# EAGLE design HCPL-7840 (EAGLE 6.4)
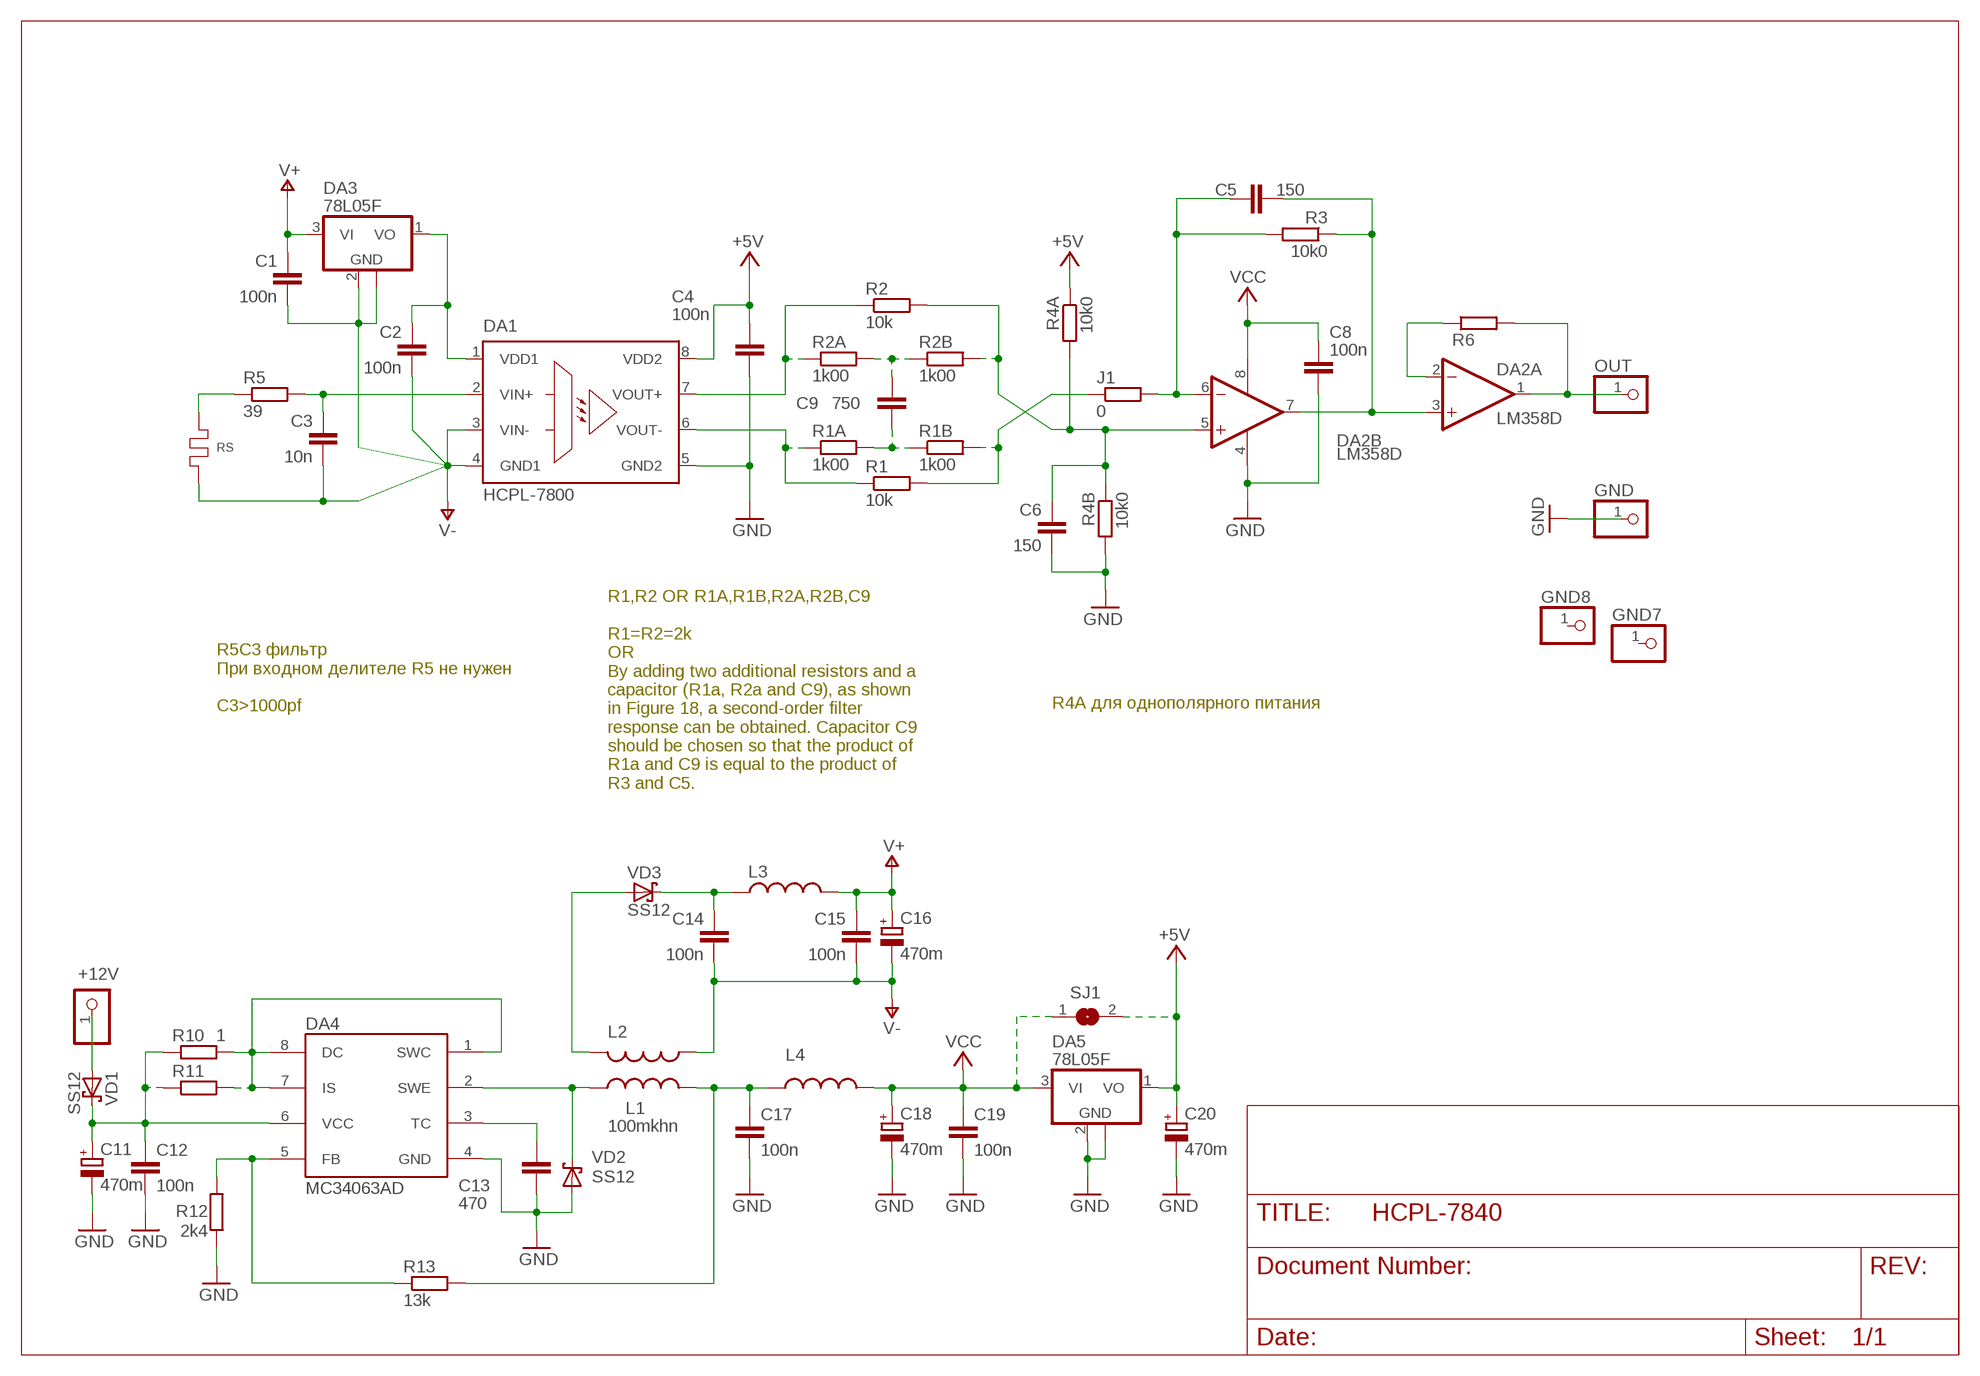
[diagram p0: schematic, sheet 1]

## Parts
+12V  PINHD-1X1  [1X01]
C1  100n  C-EUC0805  [C0805]
C2  100n  C-EU075-032X103  [C075-032X103]
C3  10n  C-EUC0805  [C0805]
C4  100n  C-EU075-032X103  [C075-032X103]
C5  150  C-EUC0805  [C0805]
C6  150  C-EUC0805  [C0805]
C8  100n  C-EU075-032X103  [C075-032X103]
C9  750  C-EUC0805  [C0805]
C11  470m  CPOL-EUE2.5-5  [E2,5-5]
C12  100n  C-EUC0805  [C0805]
C13  470  C-EUC0805  [C0805]
C14  100n  C-EUC0805  [C0805]
C15  100n  C-EUC0805  [C0805]
C16  470m  CPOL-EUE2.5-5  [E2,5-5]
C17  100n  C-EUC0805  [C0805]
C18  470m  CPOL-EUE2.5-5  [E2,5-5]
C19  100n  C-EUC0805  [C0805]
C20  470m  CPOL-EUE2.5-5  [E2,5-5]
DA1  HCPL-7800  [DIL08]
DA2  LM358D  [SO08]
DA3  78L05F  [SOT89]
DA4  MC34063AD  [SOIC8]
DA5  78L05F  [SOT89]
GND  PINHD-1X1  [1X01]
GND7  PINHD-1X1  [1X01]
GND8  PINHD-1X1  [1X01]
J1  0  R-EU_R1206W  [R1206W]
L1  100mkhn  L-USLAN02KR  [LAN02KR]
L2  L-USLAN02KR  [LAN02KR]
L3  L0204/7  [0204/7]
L4  L-US0204/7  [0204/7]
OUT  PINHD-1X1  [1X01]
R1  10k  R-EU_M0805  [M0805]
R1A  1k00  R-EU_M0805  [M0805]
R1B  1k00  R-EU_M0805  [M0805]
R2  10k  R-EU_M0805  [M0805]
R2A  1k00  R-EU_M0805  [M0805]
R2B  1k00  R-EU_M0805  [M0805]
R3  10k0  R-EU_M0805  [M0805]
R4A  10k0  R-EU_M0805  [M0805]
R4B  10k0  R-EU_M0805  [M0805]
R5  39  R-EU_M0805  [M0805]
R6  R-EU_M0805  [M0805]
R10  1  R-EU_M1206  [M1206]
R11  R-EU_M1206  [M1206]
R12  2k4  R-EU_M0805  [M0805]
R13  13k  R-EU_0207/10  [0207/10]
RS  R  [75ШС]
SJ1  SJ  [SJ]
VD1  SS12  SCHOTTKY-DIODESMD  [SMB]
VD2  SS12  SCHOTTKY-DIODESMD  [SMB]
VD3  SS12  SCHOTTKY-DIODESMD  [SMB]

## Nets
+5V: C4.1 C20.+ DA1.8(VDD2) DA5.1(VO) R4A.1 SJ1.2
GND: C4.2 C6.2 C8.2 C11.- C12.2 C13.2 C17.2 C18.- C19.2 C20.- DA1.5(GND2) DA2.4(P:V-) DA4.4(GND) DA5.2(GND) DA5.2@1(GND) GND.1 R4B.2 R12.1 VD2.A
N$1: C3.1 DA1.2(VIN+) R5.2
N$2: C2.1 DA1.1(VDD1) DA3.1(VO)
N$3: C9.2 R1A.2 R1B.1
N$4: C9.1 R2A.2 R2B.1
N$5: C5.2 DA2.3(A:+IN) DA2.7(B:OUT) R3.1
N$6: DA1.7(VOUT+) R2.1 R2A.1
N$7: DA1.6(VOUT-) R1.1 R1A.1
N$8: C6.1 DA2.5(B:+IN) R2.2 R2B.2 R4A.2 R4B.1
N$9: C5.1 DA2.6(B:-IN) J1.2 R3.2
N$10: C11.+ C12.1 DA4.6(VCC) R10.1 R11.1 VD1.C
N$11: +12V.1 VD1.A
N$12: C17.1 L1.2 L4.1 R13.2
N$13: DA2.1(A:OUT) OUT.1 R6.2
N$14: DA2.2(A:-IN) R6.1
N$16: L2.1 VD3.A
N$17: C14.1 L3.1 VD3.C
N$18: DA4.5(FB) R12.2 R13.1
N$19: J1.1 R1.2 R1B.2
N$20: DA4.1(SWC) DA4.7(IS) DA4.8(DC) R10.2 R11.2
N$21: DA4.2(SWE) L1.1 VD2.C
N$22: C13.1 DA4.3(TC)
R_SENSE: R5.1 RS.P$2
V+: C1.1 C15.1 C16.+ DA3.3(VI) L3.2
V-: C1.2 C2.2 C3.2 C14.2 C15.2 C16.- DA1.3(VIN-) DA1.4(GND1) DA3.2(GND) DA3.2@1(GND) L2.2 RS.P$1
VCC: C8.1 C18.+ C19.1 DA2.8(P:V+) DA5.3(VI) L4.2 SJ1.1
Unconnected: GND7.1 GND8.1

## Notes on the sheet
- R1,R2 OR R1A,R1B,R2A,R2B,C9
  
  R1=R2=2k
  OR
  By adding two additional resistors and a
  capacitor (R1a, R2a and C9), as shown 
  in Figure 18, a second-order filter 
  response can be obtained. Capacitor C9 
  should be chosen so that the product of 
  R1a and C9 is equal to the product of 
  R3 and C5.
- R5C3 фильтр
  При входном делителе R5 не нужен
  
  C3>1000pf
- R4A для однополярного питания

## Library data of the parts
+12V GND GND7 GND8 OUT = Разъёмы штырьковые 2.54мм:PINHD-1X1: PIN HEADER
C1-C6 C8 C9 C12-C15 C17 C19 = rcl:C-EU: CAPACITOR, European symbol
C11 C16 C18 C20 = rcl:CPOL-EU: POLARIZED CAPACITOR, European symbol
DA1 = avago:HCPL-7800: Isolation Amplifer Source: http://www.avagotech.com/docs/AV02-0410EN; MPN: HCPL-7800A#500; OC_FARNELL: 459446; OC_NEWARK: 05M6395
DA2 = linear:LM358: OP AMP also LM158; LM258; LM2904 Source: http://cache.national.com/ds/LM/LM158.pdf
DA3 DA5 = linear:78L*: POSITOIV-VOLTAGE REGULATORS Output up to 100 mA Source: http://focus.ti.com/lit/ds/symlink/ua78l05.pdf
DA4 = MC34063:MC34063
J1 R1 R1A R1B R2 R2A R2B R3 R4A R4B R5 R6 R10-R13 = rcl:R-EU_: RESISTOR, European symbol
L1 L2 L4 = rcl:L-US: INDUCTOR, American symbol
L3 = rcl:L: INDUCTOR, American symbol
RS = 75ShS:R
SJ1 = jumper:SJ: SMD solder JUMPER
VD1-VD3 = diode:SCHOTTKY-DIODE: Schottky Diode

## Board
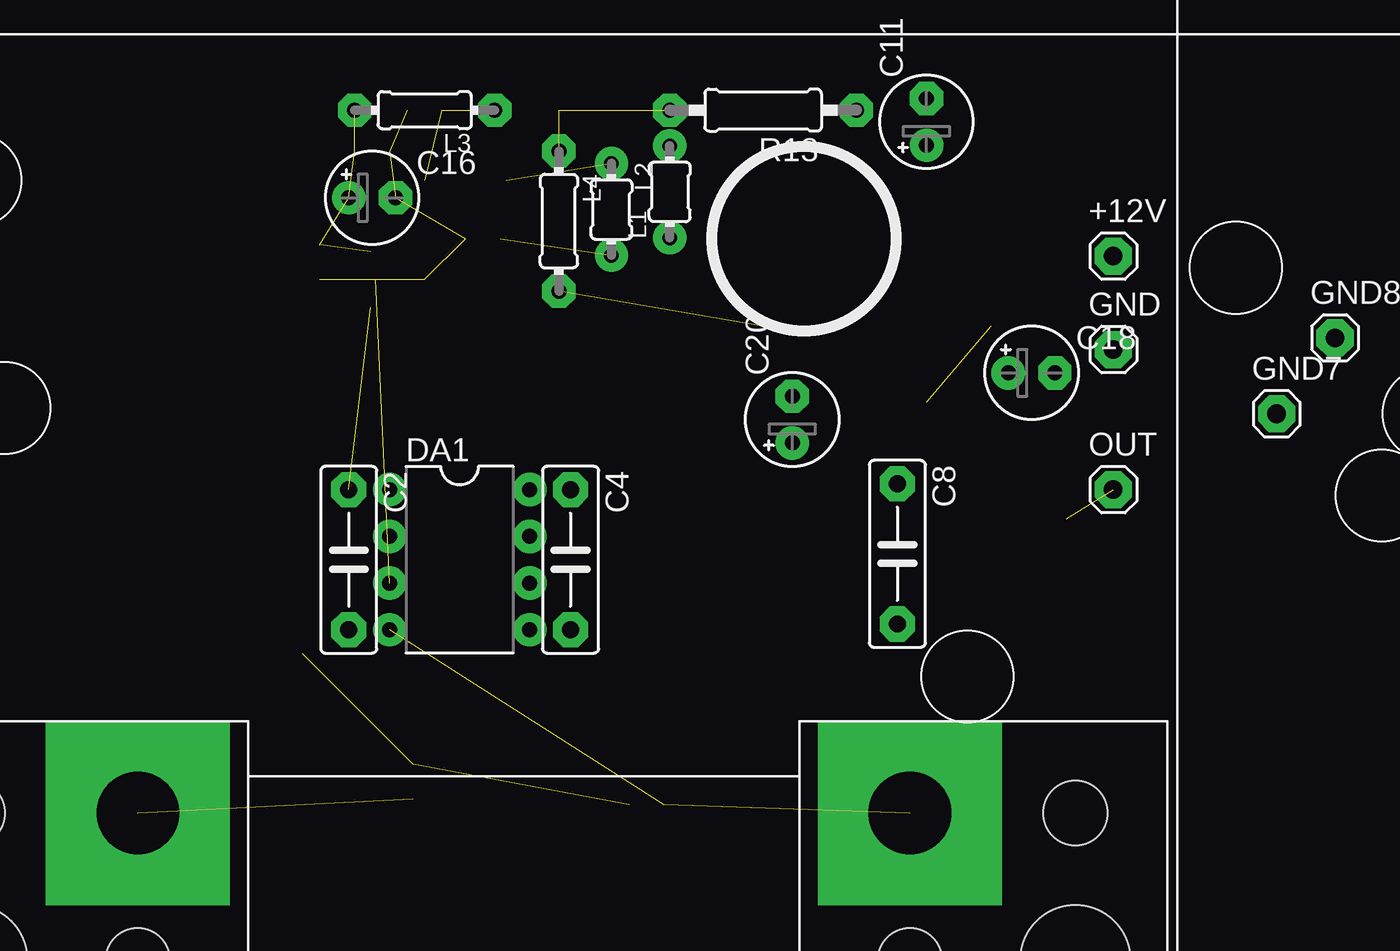
[diagram p1: board, top side]
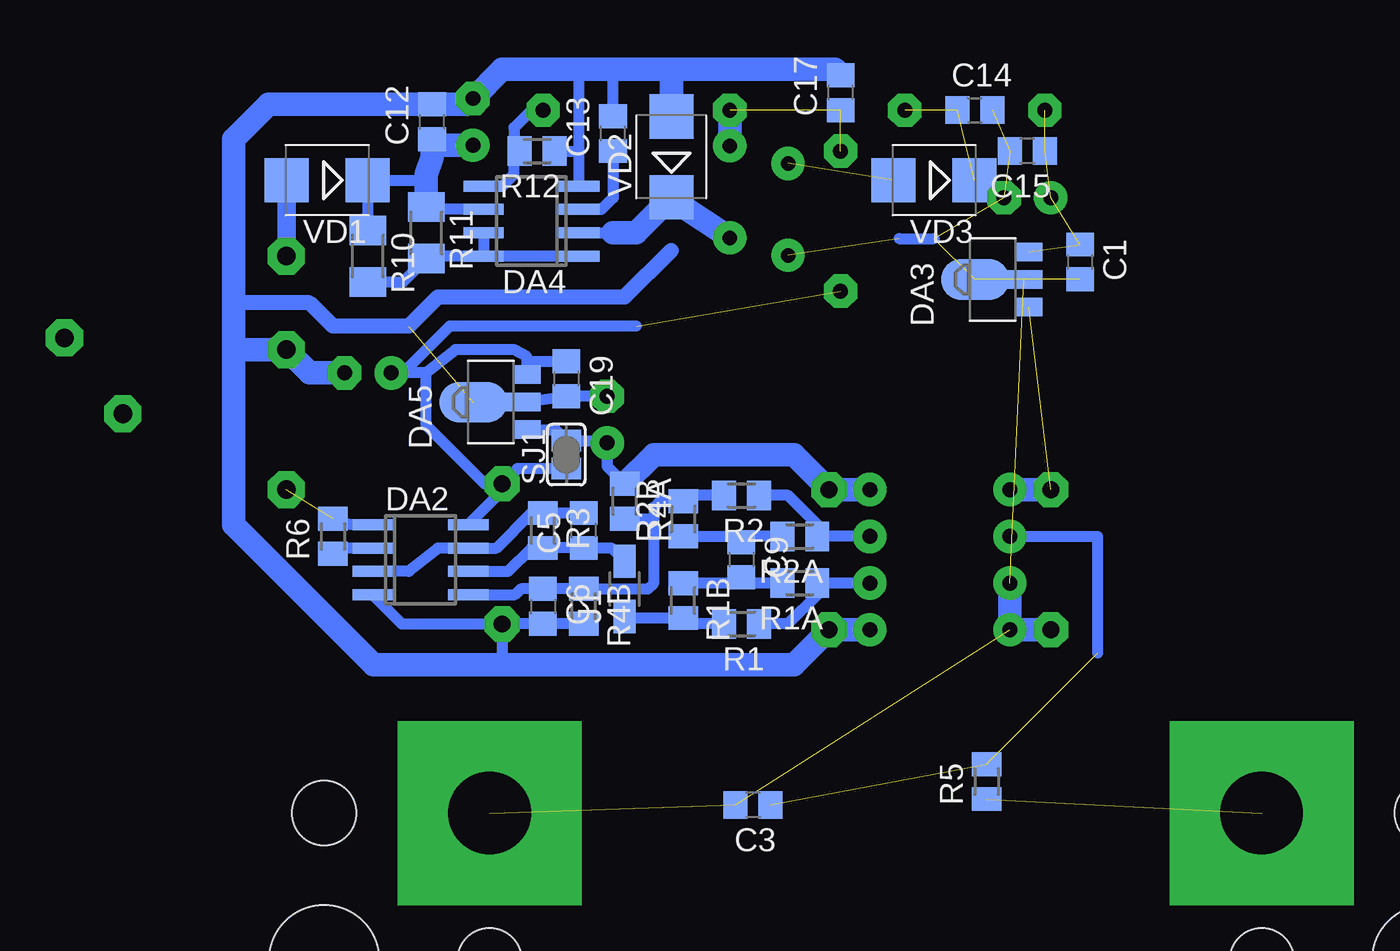
[diagram p2: board, bottom side, seen from below]

No outline drawn. Coordinates in mm, seen from the top.
Copper layers (1*16): Top 0.035mm / dielectric 1.5mm / Bottom 0.035mm
Design rules "DesignRules": minimum track width 8mil, minimum drill 24mil, track to track 0.2mm, track to pad 0.2mm, pad to pad 8mil, via to via 8mil, smd to smd 8mil, copper to edge 10mil, drill to drill 8mil, minimum pad ring 0.5mm, minimum via ring 8mil, stop-mask expansion 4mil, vias tented up to drill 0mil, thermal gap 10mil

### Footprints (pad centres in the part's own frame; a part is rotated, then mirrored left to right if it is on the bottom)
1X01 = drill 1.016 octagon: 1 0,0
C0805 = smd 1.3 x 1.5: 1 -0.95,0; 2 0.95,0
C075-032X103 = drill 0.914 octagon: 1 -3.81,0; 2 3.81,0
E2,5-5 = drill 0.813 pad 1.6: + -1.27,0 | drill 0.813 pad 1.6 octagon: - 1.27,0
DIL08 = drill 0.813 pad 1.3: 1 -3.81,-3.81; 2 -1.27,-3.81; 3 1.27,-3.81; 4 3.81,-3.81; 5 3.81,3.81; 6 1.27,3.81; 7 -1.27,3.81; 8 -3.81,3.81
SO08 = smd 0.6 x 2.2: 1 -1.905,-2.6; 2 -0.635,-2.6; 3 0.635,-2.6; 4 1.905,-2.6; 5 1.905,2.6; 6 0.635,2.6; 7 -0.635,2.6; 8 -1.905,2.6
SOT89 = smd 1 x 1.5: 1 -1.499,-1.981; 3 1.499,-1.981 | smd 1 x 2: 2 0,-1.727 | smd 2.2 x 3.7: 2@1 0,0.94
SOIC8 = smd 0.6 x 2.2: 1 -1.905,-2.6; 2 -0.635,-2.6; 3 0.635,-2.6; 4 1.905,-2.6; 5 1.905,2.6; 6 0.635,2.6; 7 -0.635,2.6; 8 -1.905,2.6
R1206W = smd 1.8 x 1.2: 1 -1.499,0; 2 1.499,0
LAN02KR = drill 0.8 pad 1.3: 1 -2.5,0; 2 2.5,0
0204/7 = drill 0.813 octagon: 1 -3.81,0; 2 3.81,0
M0805 = smd 1.3 x 1.6: 1 -0.95,0; 2 0.95,0
M1206 = smd 1.6 x 2: 1 -1.4,0; 2 1.4,0
0207/10 = drill 0.813 octagon: 1 -5.08,0; 2 5.08,0
75ШС = drill 4.5 pad 10 square: P$1 -21,-4; P$2 21,-4 | hole 6: -30,4; 30,4 | hole 3.5: 30,-4; -30,-4; -21,4; 21,4
SJ = smd 1.168 x 1.6: 1 -0.762,0; 2 0.762,0
SMB = smd 2.4 x 2.4: A 2.2,0; C -2.2,0

### Placement (x,y rotation side)
+12V  18.73,31.75 0 top
C1  -24.45,31.43 270 bottom
C2  -22.86,15.24 270 top
C3  -6.67,1.91 180 bottom
C4  -10.79,15.24 270 top
C5  2.54,16.83 90 bottom
C6  4.76,12.7 270 bottom
C8  6.99,15.56 270 top
C9  -6.03,15.24 270 bottom
C11  8.57,39.05 90 top
C12  10.79,39.05 90 bottom
C13  0.95,38.42 90 bottom
C14  -18.73,39.69 0 bottom
C15  -21.59,37.47 180 bottom
C16  -21.59,34.92 0 top
C17  -11.43,40.64 90 bottom
C18  14.29,25.4 0 top
C19  3.49,25.08 270 bottom
C20  1.27,22.86 90 top
DA1  -16.83,15.24 270 top
DA2  11.43,15.24 270 bottom
DA3  -19.68,30.48 90 bottom
DA4  5.4,33.66 90 bottom
DA5  7.62,23.81 90 bottom
GND  18.73,26.67 0 top
GND7  27.62,23.18 0 top
GND8  30.8,27.3 0 top
J1  0.32,13.65 90 bottom
L1  -5.4,35.24 90 top
L2  -8.57,34.29 270 top
L3  -18.73,39.69 180 top
L4  -11.43,33.66 270 top
OUT  18.73,19.05 0 top
R1  -6.03,11.75 180 bottom
R1A  -9.21,13.97 180 bottom
R1B  -2.86,13.02 270 bottom
R2  -6.03,18.73 180 bottom
R2A  -9.21,16.51 180 bottom
R2B  -2.86,17.46 90 bottom
R3  4.76,16.83 270 bottom
R4A  0.32,18.41 270 bottom
R4B  2.54,12.7 270 bottom
R5  -19.37,3.17 90 bottom
R6  16.19,16.51 90 bottom
R10  14.29,31.75 270 bottom
R11  11.11,33.02 270 bottom
R12  5.08,37.47 180 bottom
R13  -0.32,39.69 180 top
RS  -13.34,-2.54 180 top
SJ1  3.49,20.95 90 bottom
VD1  16.51,35.88 180 bottom
VD2  -2.22,37.15 90 bottom
VD3  -16.51,35.88 180 bottom

### Tracks (layer width: path | path; a pad name or v marks a point on that pad's centre or on a via)
+5V
  Bottom 0.61: R4A.1 1.27,20.32 C20.+ 1.4,21.72 SJ1.2 4.09,22.31 DA5.1
  Bottom 1.27: DA1.8 C4.1 -8.89,20.95 -1.27,20.95 R4A.1
GND  (1 unrouted)
  Bottom 0.61: R4B.2 C6.2 C8.2 | 12.44,9.59 12.38,9.53 | DA4.4 2.8,37.47 | 2.8,37.47 2.8,41.85 2.86,41.91 | R12.1 2.8,37.47 | C13.2 0.95,41.91 | DA5.2@1 DA5.2 C19.2 C20.- | C8.2 6.99,9.53 | DA2.4 12.44,11.75 C8.2
  Bottom 0.813: -2.22,32.07 0.32,29.53 10.48,29.53 12.06,27.94 16.19,27.94 17.46,29.21 21.59,29.21
  Bottom 1.27: DA1.5 C4.2 -8.89,9.53 6.99,9.53 12.38,9.53 13.97,9.53 21.59,17.14 21.59,26.67 | -2.22,41.91 0.95,41.91 2.86,41.91 6.99,41.91 C11.- 8.89,40 C12.2 19.69,40 21.59,38.1 21.59,29.21 21.59,26.67 | -2.22,41.91 VD2.A | -2.22,41.91 -11.11,41.91 C17.2 | 21.59,26.67 GND.1 17.46,25.4 C18.-
N$1  (2 unrouted)
  Bottom 0.61: DA1.2 -25.4,16.51 -25.4,10.16
N$2  (1 unrouted)
  Bottom 1.27: C2.1 DA1.1
N$3
  Bottom 0.61: R1A.2 -6.03,13.97 | -6.03,13.97 C9.2 | -6.03,13.97 R1B.1
N$4
  Bottom 0.61: R2A.2 -6.03,16.51 C9.1 -6.03,16.51 R2B.1
N$5
  Bottom 0.61: C5.2 R3.1 | 5.08,17.46 R3.1 | DA2.3 12.06,14.61 10.48,15.88 DA2.7 7.3,15.88 5.4,17.78 R3.1
N$6
  Bottom 0.61: R2.1 -8.57,18.73 -10.16,17.15 R2A.1 DA1.7
N$7
  Bottom 0.61: R1.1 -8.57,11.75 -10.16,13.33 R1A.1 DA1.6
N$8
  Bottom 0.61: R4B.1 | R4B.1 C6.1 5.97,13.65 6.29,13.34 DA2.5 | R2.2 -2.86,18.73 R2B.2 -1.59,18.41 -1.27,18.1 -1.27,17.46 | R4B.1 -0.95,13.65 -1.27,13.97 -1.27,17.46 | R4A.2 -1.27,17.46
N$9
  Bottom 0.61: C5.1 R3.2 | 5.08,16.19 R3.2 | C5.1 | C5.1 1.04,15.88 J1.2 | DA2.6 6.67,14.61 5.4,15.88 R3.2
N$10
  Bottom 0.61: DA4.6 10.98,34.29 R11.1 11.11,34.61 | R10.1 14.29,35.85 VD1.C 11.11,35.88
  Bottom 1.27: R11.1 11.11,35.88 11.11,36.17 10.79,37.12 C12.1 10.47,37.78 C11.+
N$11
  Bottom 1.016: VD1.A 18.71,32.05 +12V.1
N$12  (2 unrouted)
  Bottom 0.61: R13.2
  Bottom 1.27: L1.2 R13.2
N$13  (1 unrouted)
  Bottom 0.61: DA2.1 15.24,17.14 R6.2
N$14
  Bottom 0.61: DA2.2 15.56,15.88 R6.1
N$16  (1 unrouted)
N$17  (2 unrouted)
N$18
  Bottom 0.61: DA4.5 6.99,35.56 6.35,36.2 6.35,37.46 R12.2 6.35,37.47 6.35,38.73 5.4,39.69 R13.1
N$19
  Bottom 0.61: R1.2 -2.86,11.75 R1B.2 0.32,12.07 J1.1
N$20
  Bottom 0.61: DA4.7 DA4.8 | DA4.8 10.98,31.75 R11.2 12.38,30.35 R10.2 | DA4.1 DA4.8
N$21
  Bottom 0.61: DA4.2 0.95,33.02
  Bottom 1.27: L1.1 -2.52,34.65 VD2.C -0.29,33.02 0.95,33.02
N$22
  Bottom 0.61: C13.1 0.95,34.92 1.59,34.29 DA4.3
R_SENSE  (1 unrouted)
V+  (4 unrouted)
V-  (10 unrouted)
  Bottom 0.61: -14.61,32.7 -16.51,32.7
  Bottom 1.27: C2.2 DA1.4 DA1.3
VCC  (1 unrouted)
  Bottom 0.61: C19.1 5.24,26.03 DA5.3 5.64,26.28 6.35,26.67 9.53,26.67 11.11,25.4 | -0.32,27.94 9.84,27.94 12.38,25.4 | 12.38,25.4 C18.+ | 11.11,25.4 11.11,22.54 7.94,19.37 C8.1 | 11.11,25.4 12.38,25.4 | DA2.8 6.99,18.99 C8.1 | SJ1.1 6.16,20.19 C8.1